# Altium schematic sheet Power.SchDoc
size A; SheetNumber: 1; SheetTotal: 5
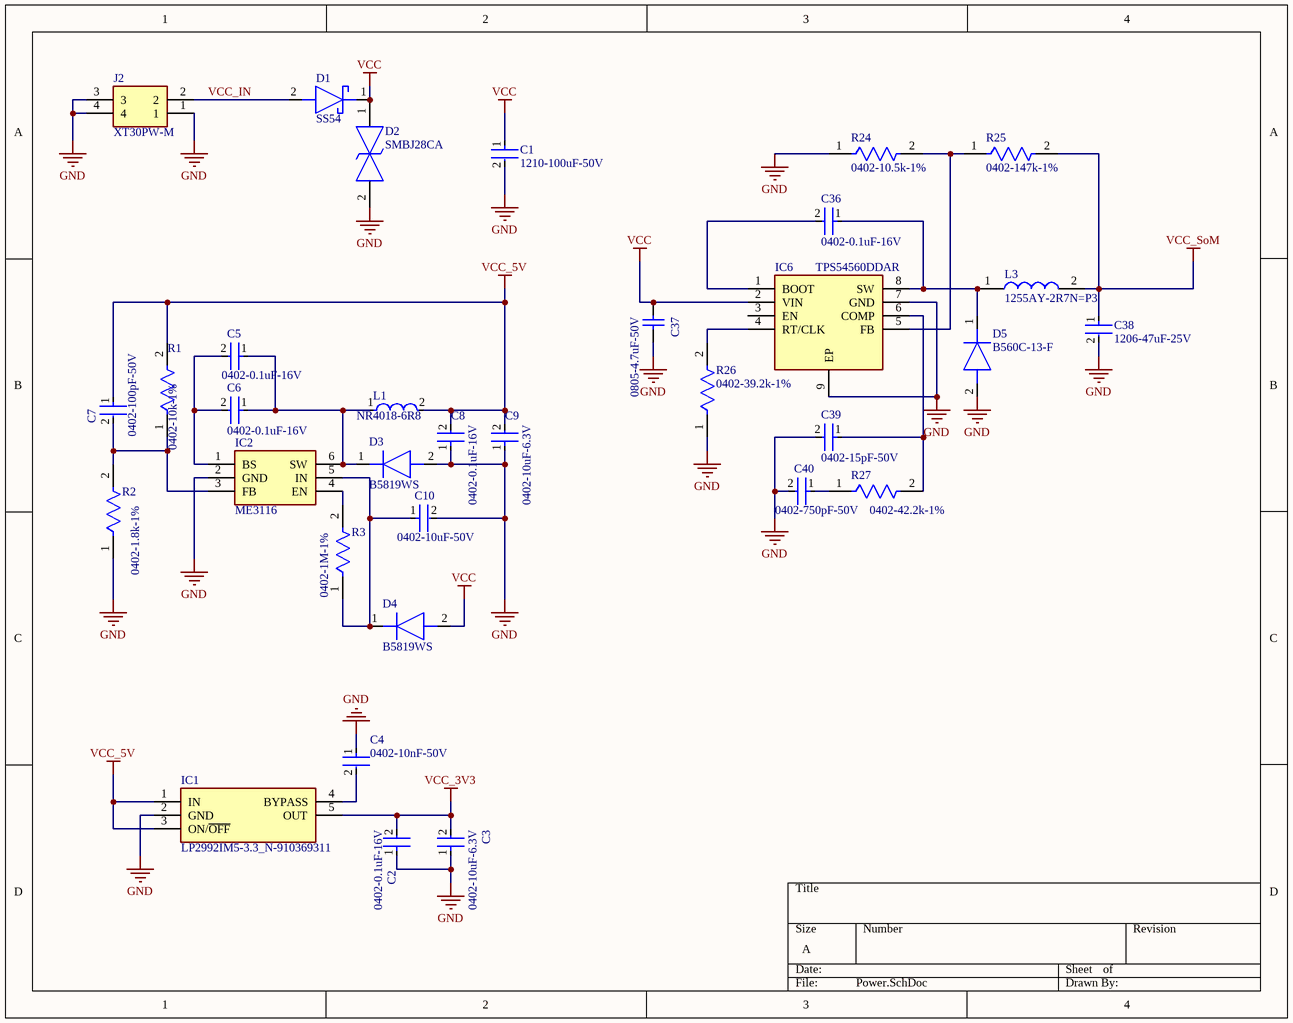
[diagram p0: Power.SchDoc]

## Parts
C1  1210-100uF-50V  [FP-1210-L_3_3_0_4-W_2_5_0-IPC_B]
C2  0402-0.1uF-16V  [FP-GRM155-0_05-IPC_A]
C3  0402-10uF-6.3V  [FP-GRM155-0_05-IPC_A]
C4  0402-10nF-50V  [FP-GRM155-0_05-IPC_A]
C5  0402-0.1uF-16V  [FP-GRM155-0_05-IPC_A]
C6  0402-0.1uF-16V  [FP-GRM155-0_05-IPC_A]
C7  0402-100pF-50V  [FP-GRM155-0_05-IPC_A]
C8  0402-0.1uF-16V  [FP-GRM155-0_05-IPC_A]
C9  0402-10uF-6.3V  [FP-GRM155-0_05-IPC_A]
C10  0402-10uF-50V  [FP-GRM155-0_05-IPC_A]
C36  0402-0.1uF-16V  [FP-GRM155-0_05-IPC_A]
C37  0805-4.7uF-50V  [CAPC2013X88X50LL20T25]
C38  1206-47uF-25V  [FP-C3216-160-0_3-IPC_C]
C39  0402-15pF-50V  [FP-GRM155-0_05-IPC_A]
C40  0402-750pF-50V  [FP-GRM155-0_05-IPC_A]
D1  SS54  [DIOM5026X262N]
D2  SMBJ28CA  [DIONM5436X244N]
D3  B5819WS  [SOD2613X100N]
D4  B5819WS  [SOD2613X100N]
D5  B560C-13-F  [DIOM7959X250N]
IC1  LP2992IM5-3.3_N-910369311  [SOT95P280X145-5N]
IC2  ME3116  [SOT95P270X145-6N]
IC6  TPS54560DDAR  [SOIC127P600X170-9N]
J2  XT30PW-M  [XT30PWM]
L1  NR4018-6R8  [FP-NR4018-MFG]
L3  1255AY-2R7N=P3  [1255AY100MP3]
R1  0402-10k-1%  [FP-CRCW0402-e3-IPC_C]
R2  0402-1.8k-1%  [FP-CRCW0402-e3-IPC_C]
R3  0402-1M-1%  [FP-CRCW0402-e3-IPC_C]
R24  0402-10.5k-1%  [FP-CRCW0402-e3-IPC_C]
R25  0402-147k-1%  [FP-CRCW0402-e3-IPC_C]
R26  0402-39.2k-1%  [FP-CRCW0402-e3-IPC_C]
R27  0402-42.2k-1%  [FP-CRCW0402-e3-IPC_C]

## Nets
GND: C1.2 C2.1 C3.1 C4.1 C8.1 C9.1 C10.2 C37.1 C38.2 C39.2 C40.2 D2.2 D3.2(A) D5.2(A) IC1.2(GND) IC2.2(GND) IC6.7(GND) IC6.9(EP) J2.1 J2.3 J2.4 R2.1 R24.1 R26.1
VCC: C1.1 C37.2 D1.1(K) D2.1 D4.2(A) IC6.2(VIN)
VCC_3V3: C2.2 C3.2 IC1.5(OUT)
VCC_5V: C7.1 C8.2 C9.2 IC1.1(IN) IC1.3(ON/~{OFF}) L1.2 R1.2
VCC_SoM: C38.1 L3.2 R25.2
VCC_IN: D1.2(A) J2.2
NetC4_2: C4.2 IC1.4(BYPASS)
NetC5_1: C5.1 C6.1 D3.1(K) IC2.6(SW) L1.1
NetC5_2: C5.2 C6.2 IC2.1(BS)
NetC7_2: C7.2 IC2.3(FB) R1.1 R2.2
NetC10_1: C10.1 D4.1(K) IC2.5(IN) R3.1
NetC36_1: C36.1 D5.1(K) IC6.8(SW) L3.1
NetC36_2: C36.2 IC6.1(BOOT)
NetC39_1: C39.1 IC6.6(COMP) R27.2
NetC40_1: C40.1 R27.1
NetIC2_4: IC2.4(EN) R3.2
NetIC6_4: IC6.4(RT/CLK) R26.2
NetIC6_5: IC6.5(FB) R24.2 R25.1

Not connected (* = marked no-connect by the designer): IC6 3(EN)

## Library data of the parts
C1 = CMP-04427-007940-1: General Purpose Ceramic Capacitor, 1210, 22uF, 10%, X7R, 15%, 16V; Voltage: 10V; Insulation Resistance: 100GR; Dissipation Factor: 3.5%; REACH SVHC: No SVHC; Lead Free: Lead Free; Length: 3.2mm; Termination: SMD/SMT; Voltage Rating (DC): 16V; Radiation Hardening: No; RoHS Compliant: Yes; Case/Package: 1210; Case Code (Metric): 3225; Capacitance: 22uF; Width: 0.098inch; Packaging: Tape and Reel; Dielectric: X7R; Min Operating Temperature: -55°C; Max Operating Temperature: 125°C; Package Quantity: 1000; Series: Standard; Thickness: 0.11inch; Contact Plating: Tin; Tolerance: 10%; Height: 2.79mm; Mount: Surface Mount; Case Code (Imperial): 1210; Depth: 2.5mm; Voltage Rating: 16V; Number of Pins: 2; Construction: Flat
C2-C10 C36 C39 C40 = CMP-2008-04561-5: CAP CER 0.22UF 10V X5R 0402; Tolerance: 10%; Capacitance: 220nF; Material: Ceramic; Insulation Resistance: 10GR; Package Quantity: 1; Termination: SMD/SMT; Max Operating Temperature: 85°C; Voltage: 10V; REACH SVHC: No SVHC; Thickness: 0.022inch; Mount: Surface Mount; Height: 0.5mm; Length: 1mm; Lead Free: Lead Free; Number of Pins: 2; Case Code (Imperial): 0402; Case/Package: 0402; Min Operating Temperature: -55°C; Packaging: Tape and Reel; Dielectric: X5R; Depth: 0.5mm; Series: GRM; Case Code (Metric): 1005; Radiation Hardening: No; RoHS Compliant: Yes; Voltage Rating (DC): 10V; Voltage Rating: 10V; Dielectric Material: Ceramic; Width: 0.5mm
C37 = CMP-2007-00266-1: Manufacturer: Kemet; Part Number: C0805C103K5RACTU
C38 = CMP-2000-05396-3: Multilayer Ceramic Capacitors 100uF ±20% 10V X5R SMD 1206; Voltage Rating (DC): 10V; Length: 3.2mm; Mount: Surface Mount; Depth: 1.6mm; Width: 1.6mm; Package Quantity: 1; Min Operating Temperature: -55°C; Packaging: Tape and Reel; Max Operating Temperature: 85°C; Dielectric: X5R; Construction: Flat; Case Code (Imperial): 1206; Capacitance: 100uF; Thickness: 0.075inch; Radiation Hardening: No; RoHS Compliant: Yes; Series: C; Dielectric Material: Ceramic; Voltage: 10V; REACH SVHC: No SVHC; Case Code (Metric): 3216; Weight: 0.000571oz; Height: 1.6mm; Voltage Rating: 10V; Termination: SMD/SMT; Lead Free: Lead Free; Tolerance: 20%; Case/Package: 1206; Resistor Type: Ceramic
D1 = SS54: Schottky Diode; Manufacturer_Name: DIYI Elec Tech; Datasheet Link: https://datasheet.lcsc.com/szlcsc/DIYI-Elec-Tech-SS54_C84165.pdf; Height: 2.62mm; Manufacturer_Part_Number: SS54
D2 = SMBJ28CA: TVS Diode (Bi-directional); Manufacturer_Name: Bourns; Datasheet Link: https://componentsearchengine.com/Datasheets/1/SMBJ28CA.pdf; Height: 2.44mm; Manufacturer_Part_Number: SMBJ28CA; Mouser Part Number: 652-SMBJ28CA; Mouser Price/Stock: https://www.mouser.co.uk/ProductDetail/Bourns/SMBJ28CA?qs=d7fLapxX37FKb4yeAvm1Vg%3D%3D; Arrow Part Number: SMBJ28CA; Arrow Price/Stock: https://www.arrow.com/en/products/smbj28ca/bourns?region=nac
D3 D4 = B5819WS: Diode; Manufacturer_Name: Yangzhou Yangjie Electronic Technology Co.; Datasheet Link: https://www.21yangjie.com/ggs/xxh/xxhxtdejg/B5817WS%20THRU%20B5819WS-SOD-323-%E6%B5%B7%E9%B8%A5%E8%84%9A.pdf; Height: 1mm; Manufacturer_Part_Number: B5819WS
D5 = B560C-13-F: Diode; Manufacturer_Name: Diodes Inc.; Datasheet Link: https://datasheet.lcsc.com/szlcsc/Diodes-Incorporated-B560C-13-F_C85100.pdf; Height: 2.5mm; Manufacturer_Part_Number: B560C-13-F; Mouser Part Number: 621-B560C-F; Mouser Price/Stock: https://www.mouser.co.uk/ProductDetail/Diodes-Incorporated/B560C-13-F?qs=OC0R%252Bhozcm%252BAsjMXklZLIw%3D%3D; Arrow Part Number: B560C-13-F; Arrow Price/Stock: https://www.arrow.com/en/products/b560c-13-f/diodes-incorporated?region=nac
IC1 = LP2992IM5-3.3_N-910369311: Integrated Circuit; Manufacturer_Name: Texas Instruments; Manufacturer_Part_Number: LP2992IM5-3.3/N-910369311; Datasheet Link: https://www.arrow.com/en/products/lp2992im5-3.3n-910369311/texas-instruments; Height: 1.45mm; Arrow Part Number: LP2992IM5-3.3/N-910369311; Arrow Price/Stock: https://www.arrow.com/en/products/lp2992im5-3.3n-910369311/texas-instruments
IC2 = ME3116: Integrated Circuit; Manufacturer_Name: Microne; Datasheet Link: https://datasheet.lcsc.com/szlcsc/Nanjing-Micro-One-Elec-ME3116_C97643.pdf; Height: 1.45mm; Manufacturer_Part_Number: ME3116
IC6 = TPS54560DDAR: Integrated Circuit; Manufacturer_Name: Texas Instruments; Datasheet Link: http://www.ti.com/lit/ds/symlink/tps54560.pdf; Height: 1.7mm; Manufacturer_Part_Number: TPS54560DDAR; Mouser Part Number: 595-TPS54560DDAR; Mouser Price/Stock: https://www.mouser.co.uk/ProductDetail/Texas-Instruments/TPS54560DDAR?qs=%2FA2SZCkL4Tlm1gC5t8ZNIg%3D%3D; Arrow Part Number: TPS54560DDAR; Arrow Price/Stock: https://www.arrow.com/en/products/tps54560ddar/texas-instruments?region=nac
J2 = XT30PW-M: Connector; Manufacturer_Name: Amass; Datasheet Link: https://www.tme.eu/sl/Document/ce4077e36b79046da520ca73227e15de/XT30PW%20SPEC.pdf; Height: 5mm; Manufacturer_Part_Number: XT30PW-M
L1 = CMP-14484-000658-1: SMD Power Inductors 2.2uH ±20% 1.44A 72mΩ; Shielding: Shielded; Self Resonant Frequency: 52MHz; Core Material: Ferrite; Saturation Current: 2.7A; DC Resistance (DCR): 72mR; Test Frequency: 100kHz; Current Rating: 1.44A; Inductance: 2.2uH; RoHS Compliant: Yes; Inductance Tolerance: 20%; Max DC Current: 1.44A; Package Quantity: 3500; Termination: SMD/SMT; Width: 4mm; Tolerance: 20%; Case/Package: 1515; Lead Free: Lead Free; Height: 1.8mm; Resistor Type: Wirewound; Packaging: Tape and Reel; Mount: Surface Mount; Min Operating Temperature: -25°C; Max Operating Temperature: 120°C; Number of Pins: 2; Series: NR; RMS Current (Irms): 1.44A; Height - Seated (Max): 0.071inch; Length: 0.157inch; Halogen Free: Halogen Free
L3 = 1255AY-2R7N=P3: Inductor; Manufacturer_Name: Murata Electronics; Datasheet Link: https://psearch.en.murata.com/inductor/product/1255AY-2R7N%23.html; Height: 4.5mm; Manufacturer_Part_Number: 1255AY-2R7N=P3; Mouser Part Number: 81-1255AY-2R7NP3; Mouser Price/Stock: https://www.mouser.co.uk/ProductDetail/Murata-Electronics/1255AY-2R7N%3dP3?qs=KuGPmAKtFKXDux1CpeRnvg%3D%3D; Arrow Part Number: 1255AY-2R7N=P3; Arrow Price/Stock: https://www.arrow.com/en/products/1255ay-2r7np3/murata-manufacturing
R1-R3 R24-R27 = CMP-2002-08122-2: RES Thick Film, 0Ω, 0.063W, 0402; Tolerance: 5%; Max Power Dissipation: 63mW; Voltage Rating: 50V; Temperature Coefficient: 100ppm/°C; Resistance: 0mR; Contact Plating: Tin; Height: 0.35mm; Radiation Hardening: No; Features: Automotive AEC-Q200; Composition: Thick Film; Width: 0.5mm; Weight: 2.3E-05oz; Termination: SMD/SMT; Packaging: Tape and Reel; Mount: Surface Mount; Case Code (Metric): 1005; Military Standard: Not; Min Operating Temperature: -55°C; Number of Terminations: 2; Package Quantity: 1; Case Code (Imperial): 0402; Depth: 0.5mm; Max Operating Temperature: 155°C; Case/Package: 0402; Power Rating: 63mW; Lead Free: Lead Free; Voltage Rating (DC): 50V; Length: 1mm